# EAGLE schematic Schematic for AT-AT v4 (EAGLE 9.7.0)
SIM_ABSTOL: 1e-12; SIM_AC_SWEEP_TYPE: Dec; SIM_CHGTOL: 1e-15; SIM_GMIN: 1e-12; SIM_ITL1: 100; SIM_ITL2: 50; SIM_ITL4: 10; SIM_MAX_LIMIT: 2000; SIM_METHOD: TRAP; SIM_NUMPOINTS: 500; SIM_PIVREL: 1e-3; SIM_PIVTOL: 1e-13; SIM_RELTOL: 1e-3; SIM_RSHUNT: OFF; SIM_SRCSTEPS: 0; SIM_TEMPERATURE: 25.0; SIM_THEME: light; SIM_TRAN_AC_START: 1; SIM_TRTOL: 7; SIM_TYPE: Operating Point; SIM_VNTOL: 1e-6

## Sheet 1 of 2
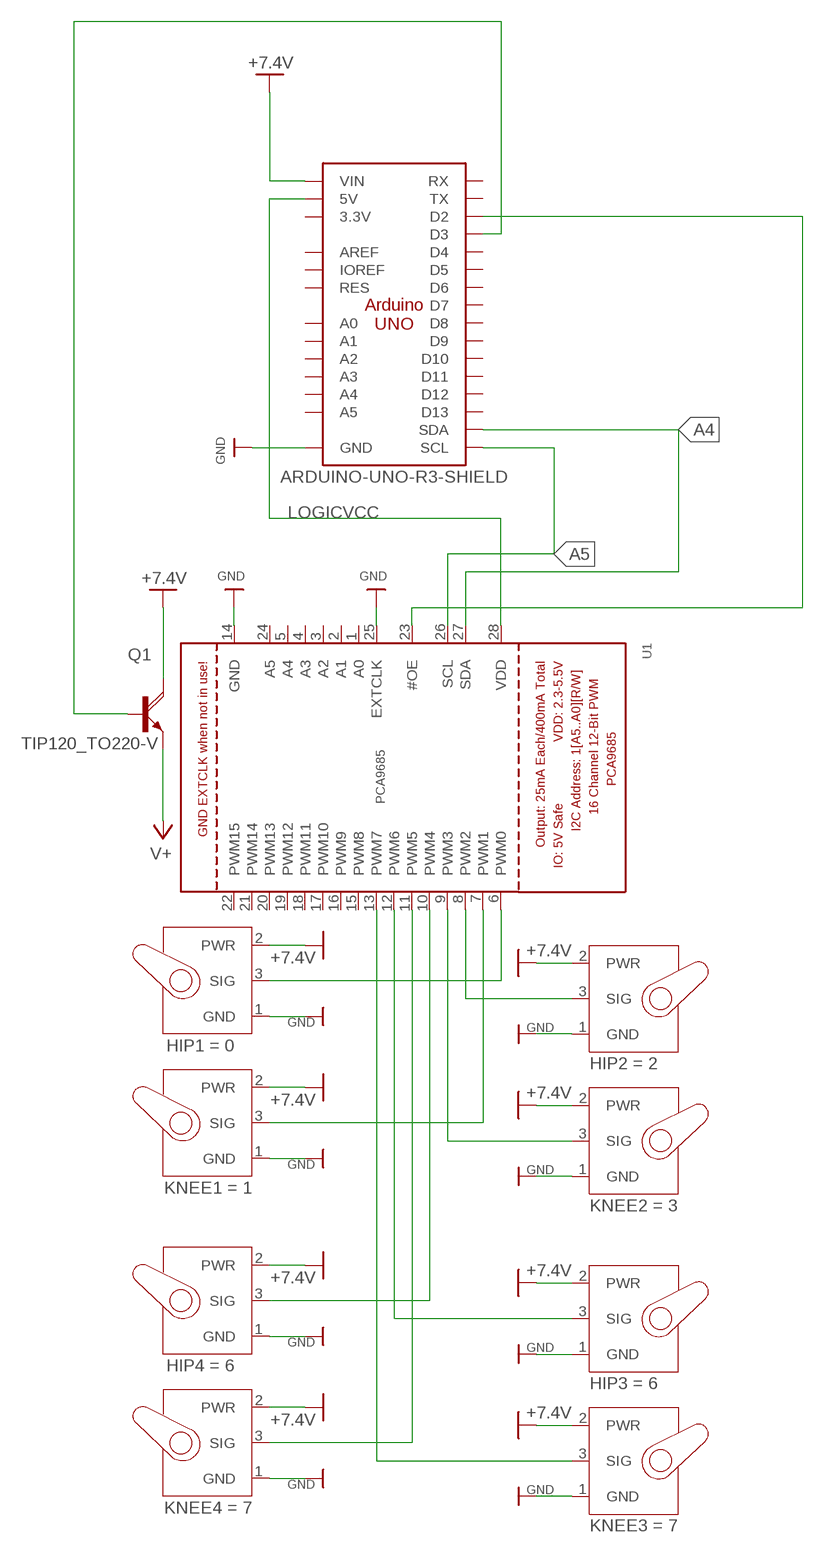
[diagram p0: schematic, sheet 1]

### Parts
Q1  TIP120_TO220-V  [TO220V]
U1  PCA9685  [TSSOP28]
U$1  SERVOSG90-HDR  [1X03]
U$2  SERVOSG90-HDR  [1X03]
U$3  SERVOSG90-HDR  [1X03]
U$4  SERVOSG90-HDR  [1X03]
U$5  SERVOSG90-HDR  [1X03]
U$6  SERVOSG90-HDR  [1X03]
U$7  SERVOSG90-HDR  [1X03]
U$8  SERVOSG90-HDR  [1X03]
U$9  ARDUINO-UNO-R3-SHIELD  [ARDUINO-UNO-R3-SHIELD]

### Nets
+7.4V: Q1.2(C) U$1.2(PWR) U$2.2(PWR) U$3.2(PWR) U$4.2(PWR) U$5.2(PWR) U$6.2(PWR) U$7.2(PWR) U$8.2(PWR) U$9.VIN
A4: U1.27(SDA) U$9.SDA ; also sheet 2
A5: U1.26(SCL) U$9.SCL ; also sheet 2
GND: U1.14(GND) U1.25(EXTCLK) U$1.1(GND) U$2.1(GND) U$3.1(GND) U$4.1(GND) U$5.1(GND) U$6.1(GND) U$7.1(GND) U$8.1(GND) U$9.GND@0(GND) U$9.GND@1(GND) U$9.GND@2(GND) ; also sheet 2
LOGICVCC: U1.28(VDD) U$9.5V
N$1: U1.6(PWM0) U$5.3(SIG)
N$2: U1.7(PWM1) U$6.3(SIG)
N$3: U1.8(PWM2) U$1.3(SIG)
N$4: U1.9(PWM3) U$2.3(SIG)
N$5: U1.10(PWM4) U$7.3(SIG)
N$6: U1.11(PWM5) U$8.3(SIG)
N$7: U1.12(PWM6) U$3.3(SIG)
N$8: U1.13(PWM7) U$4.3(SIG)
N$11: Q1.1(B) U$9.D3
N$12: U1.23(#OE) U$9.D2
V+: Q1.3(E)
Unconnected: U1.1(A0) U1.2(A1) U1.3(A2) U1.4(A3) U1.5(A4) U1.15(PWM8) U1.16(PWM9) U1.17(PWM10) U1.18(PWM11) U1.19(PWM12) U1.20(PWM13) U1.21(PWM14) U1.22(PWM15) U1.24(A5) U$9.3.3V U$9.A0 U$9.A1 U$9.A2 U$9.A3 U$9.A4 U$9.A5 U$9.AREF U$9.D4 U$9.D5 U$9.D6 U$9.D7 U$9.D8 U$9.D9 U$9.D10 U$9.D11 U$9.D12 U$9.D13 U$9.IOREF U$9.RES U$9.RX U$9.TX

## Sheet 2 of 2
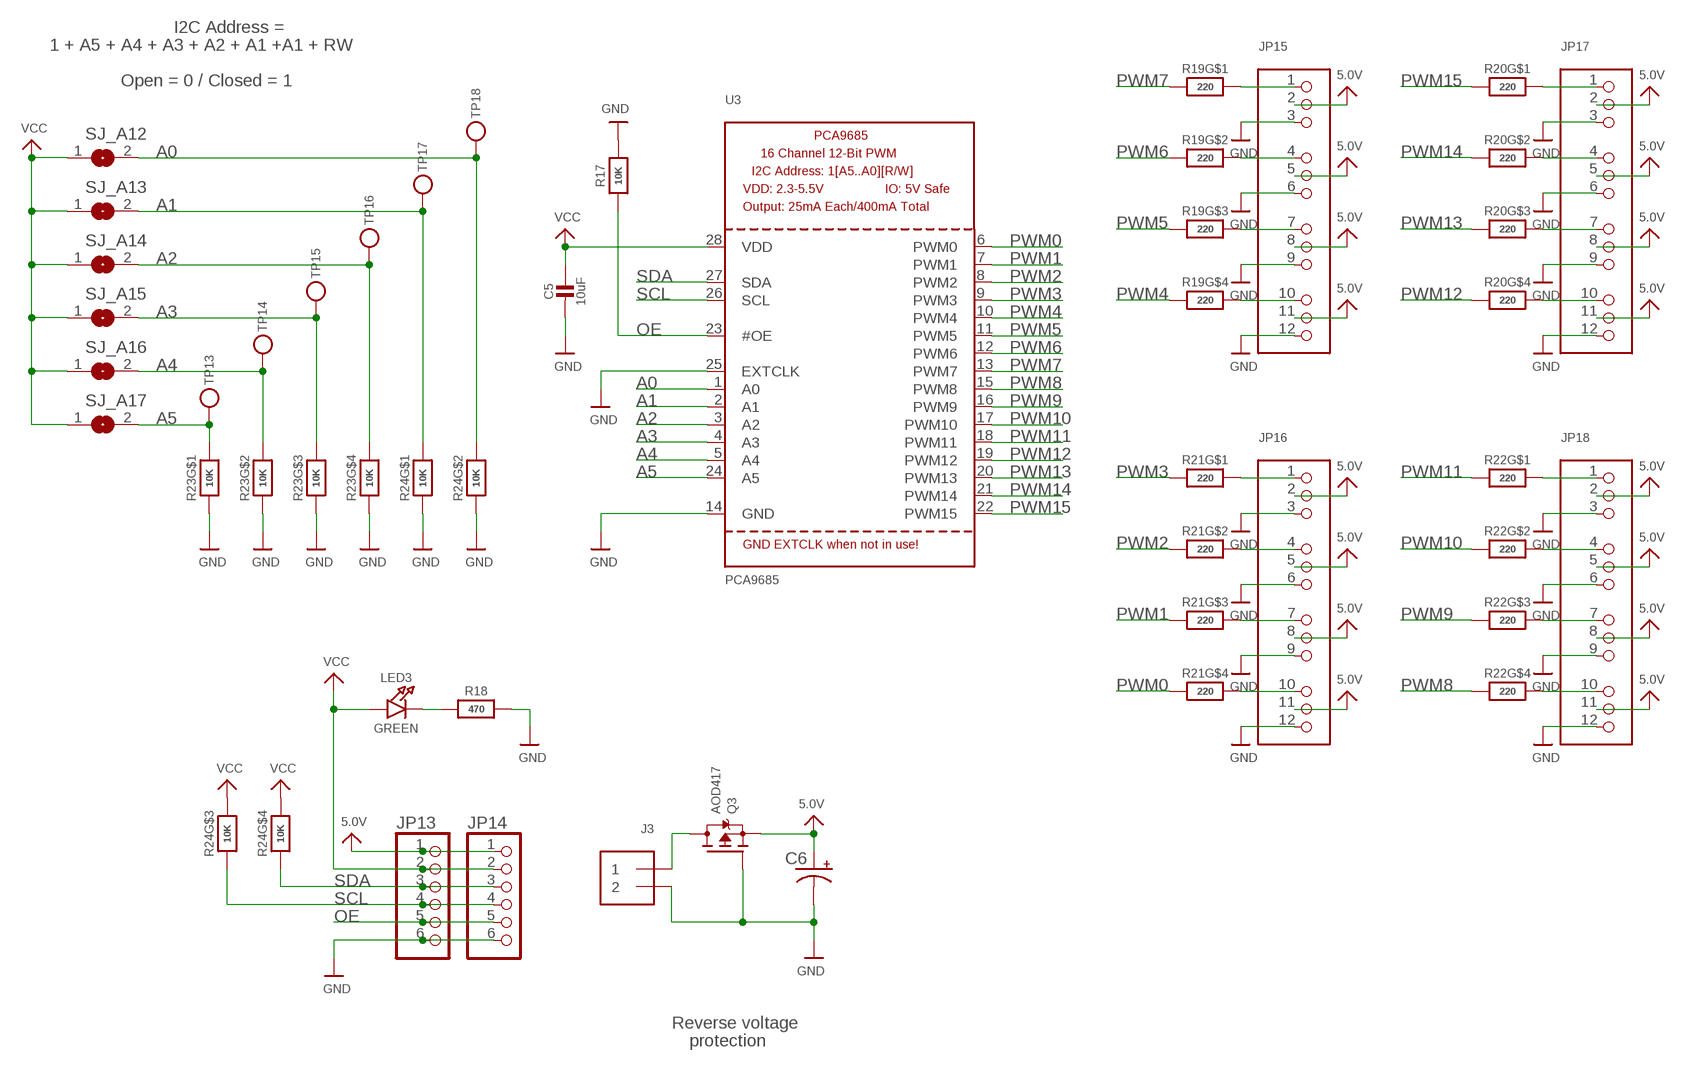
[diagram p1: schematic, sheet 2]

### Parts
C5  10uF  CAP_CERAMIC0805-NOOUTLINE  [0805-NO]
C6  CPOL-USE3.5-8  [E3,5-8]
J3  TERMBLOCK_1X2  [TERMBLOCK_1X2-3.5MM]
JP13  PINHD-1X6CB  [1X06-CLEANBIG]
JP14  PINHD-1X6CB  [1X06-CLEANBIG]
JP15  HEADER-3X04  [3X04]
JP16  HEADER-3X04  [3X04]
JP17  HEADER-3X04  [3X04]
JP18  HEADER-3X04  [3X04]
LED3  GREEN  LED0805_NOOUTLINE  [CHIPLED_0805_NOOUTLINE]
Q3  AOD417  MOSFET-PTO252  [TO252]
R17  10K  RESISTOR0805_NOOUTLINE  [0805-NO]
R18  470  RESISTOR_0805MP  [_0805MP]
R19  220  RESISTOR_4PACK  [RESPACK_4X0603]
R20  220  RESISTOR_4PACK  [RESPACK_4X0603]
R21  220  RESISTOR_4PACK  [RESPACK_4X0603]
R22  220  RESISTOR_4PACK  [RESPACK_4X0603]
R23  10K  RESISTOR_4PACK  [RESPACK_4X0603]
R24  10K  RESISTOR_4PACK  [RESPACK_4X0603]
SJ_A12  SOLDERJUMPERREFLOW_NOPASTE  [SOLDERJUMPER_REFLOW_NOPASTE]
SJ_A13  SOLDERJUMPERREFLOW_NOPASTE  [SOLDERJUMPER_REFLOW_NOPASTE]
SJ_A14  SOLDERJUMPERREFLOW_NOPASTE  [SOLDERJUMPER_REFLOW_NOPASTE]
SJ_A15  SOLDERJUMPERREFLOW_NOPASTE  [SOLDERJUMPER_REFLOW_NOPASTE]
SJ_A16  SOLDERJUMPERREFLOW_NOPASTE  [SOLDERJUMPER_REFLOW_NOPASTE]
SJ_A17  SOLDERJUMPERREFLOW_NOPASTE  [SOLDERJUMPER_REFLOW_NOPASTE]
TP13  TESTPOINTROUND1MM  [TESTPOINT_ROUND_1MM]
TP14  TESTPOINTROUND1MM  [TESTPOINT_ROUND_1MM]
TP15  TESTPOINTROUND1MM  [TESTPOINT_ROUND_1MM]
TP16  TESTPOINTROUND1MM  [TESTPOINT_ROUND_1MM]
TP17  TESTPOINTROUND1MM  [TESTPOINT_ROUND_1MM]
TP18  TESTPOINTROUND1MM  [TESTPOINT_ROUND_1MM]
U3  PCA9685  [TSSOP28]

### Nets
5.0V: C6.+ JP13.1 JP14.1 JP15.2 JP15.5 JP15.8 JP15.11 JP16.2 JP16.5 JP16.8 JP16.11 JP17.2 JP17.5 JP17.8 JP17.11 JP18.2 JP18.5 JP18.8 JP18.11 Q3.2(S)
A0: R24.7 SJ_A12.2 TP18.P$1 U3.1(A0)
A1: R24.8 SJ_A13.2 TP17.P$1 U3.2(A1)
A2: R23.5 SJ_A14.2 TP16.P$1 U3.3(A2)
A3: R23.6 SJ_A15.2 TP15.P$1 U3.4(A3)
A4: R23.7 SJ_A16.2 TP14.P$1 U3.5(A4) ; also sheet 1
A5: R23.8 SJ_A17.2 TP13.P$1 U3.24(A5) ; also sheet 1
GND: C5.2 C6.- J3.2 JP13.6 JP14.6 JP15.3 JP15.6 JP15.9 JP15.12 JP16.3 JP16.6 JP16.9 JP16.12 JP17.3 JP17.6 JP17.9 JP17.12 JP18.3 JP18.6 JP18.9 JP18.12 Q3.1(G) R17.2 R18.2 R23.1 R23.2 R23.3 R23.4 R24.1 R24.2 U3.14(GND) U3.25(EXTCLK) ; also sheet 1
N$35: LED3.C R18.1
N$36: JP15.4 R19.7
N$37: JP15.1 R19.8
N$38: JP15.7 R19.6
N$39: JP15.10 R19.5
N$40: JP16.1 R21.8
N$41: JP16.4 R21.7
N$42: JP16.7 R21.6
N$43: JP16.10 R21.5
N$44: JP18.10 R22.5
N$45: JP18.7 R22.6
N$46: JP18.4 R22.7
N$47: JP18.1 R22.8
N$48: JP17.10 R20.5
N$49: JP17.7 R20.6
N$50: JP17.4 R20.7
N$51: JP17.1 R20.8
OE: JP13.5 JP14.5 R17.1 U3.23(#OE)
PWM0: R21.4 U3.6(PWM0)
PWM1: R21.3 U3.7(PWM1)
PWM2: R21.2 U3.8(PWM2)
PWM3: R21.1 U3.9(PWM3)
PWM4: R19.4 U3.10(PWM4)
PWM5: R19.3 U3.11(PWM5)
PWM6: R19.2 U3.12(PWM6)
PWM7: R19.1 U3.13(PWM7)
PWM8: R22.4 U3.15(PWM8)
PWM9: R22.3 U3.16(PWM9)
PWM10: R22.2 U3.17(PWM10)
PWM11: R22.1 U3.18(PWM11)
PWM12: R20.4 U3.19(PWM12)
PWM13: R20.3 U3.20(PWM13)
PWM14: R20.2 U3.21(PWM14)
PWM15: R20.1 U3.22(PWM15)
PWRIN2: J3.1 Q3.3(D)
SCL: JP13.4 JP14.4 R24.3 U3.26(SCL)
SDA: JP13.3 JP14.3 R24.4 U3.27(SDA)
VCC: C5.1 JP13.2 JP14.2 LED3.A R24.5 R24.6 SJ_A12.1 SJ_A13.1 SJ_A14.1 SJ_A15.1 SJ_A16.1 SJ_A17.1 U3.28(VDD)

### Notes on the sheet
- I2C Address =
- 1 + A5 + A4 + A3 + A2 + A1 +A1 + RW
- Open = 0 / Closed = 1
- Reverse voltage
- protection

## Library data of the parts
C5 = microbuilder:CAP_CERAMIC: Ceramic Capacitors For new designs, use the packages preceded by an '_' character since they are more reliable: The following footprints should be used on most boards: _0402 - Standard footprint for regular board layouts _0603 - Standard footprint for regular board layouts _0805 - Standard footprint for regular board layouts _1206 - Standard footprint for regular board layouts For extremely tight-pitch boards where space is at a premium, the following 'micro-pitch' footprints can be used (smaller pads, no silkscreen outline, etc.): _0402MP - Micro-pitch footprint for very dense/compact boards _0603MP - Micro-pitch footprint for very dense/compact boards _0805MP - Micro-pitch footprint for very dense/compact boards _1206MP - Micro-pitch footprint for very dense/compact boards
C6 = adafruit:CPOL-US: POLARIZED CAPACITOR, American symbol
J3 = microbuilder:TERMBLOCK_1X2: 3.5mm Terminal block http://www.ladyada.net/library/pcb/eaglelibrary.html
JP13 JP14 = adafruit:PINHD-1X6: PIN HEADER
JP15-JP18 = microbuilder:HEADER-3X04
LED3 = microbuilder:LED: LED 0603 - 0603 Surface Mount Package 2mA: Green LED - Low Power (3.9mcd, 2ma, 1.7Vf) - Digikey: 475-2709-2-ND Orange LED - Low Power (9.8mcd, 2ma, 1.8Vf) - Digikey: 475-1194-2-ND Red LED - Low Power (5mcd, 2ma, 1.8Vf) - Digikey: 475-1195-2-ND Yellow LED - Low Power (7mcd, 2ma, 1.8Vf) - Digikey: 475-1196-2-ND 5mA: Blue LED - Low Power (17mcd, 5ma, 2.9Vf) - Digikey: LNJ937W8CRACT-ND 0805 - 0805 Surface Mount Package 2mA: Red LED (8.8mcd, 2mA, 1.8Vf, Clear) - Low Power [Digikey: 475-2510-1-ND] Green LED (5mcd, 2mA, 1.8Vf, Clear) - Low Power [Digikey: 475-2730-1-ND] Yellow LED (11.3mcd, 2mA, 1.8Vf, Clear) - Low Power [Digikey: 475-2555-1-ND] 20mA: Red LED (104mcd, 20mA, Diffused) - LS R976 [Digikey: 475-1278-6-ND] Red LED (12mcd, 20mA, 2.0Vf, Clear) - APT2012EC [Digikey: 754-1128-1-ND] Green LED (15mcd, 20mA, 2.2Vf, Clear) - APT2012GC [Digikey: 754-1131-1-ND] Orange LED (160mcd, 20mA, 2.1Vf, Clear) - APT2012SECK [Digikey: 754-1130-1-ND] 1206 - 1206 Surface Mount Package Green LED (26mcd, 20mA, Diffused) - LG N971 [Digikey: 475-1407-6-ND] Red LED (15mcd, 20mA, Diffused) - LH N974 [Digikey: 475-1416-6-ND] Cree - Cree High-Power Surface Mount LEDs XPEBWT-L1-0000-00D50 - White 111lm 350mA 2.9Vf 6200K 110° XTEAWT-00-0000-00000LEE3 - White 114lm 350mA 2.85Vf 5000K 115° Everlight - Everlight 45-21 Series Surface Mount LEDs 45-21/QK2C-B2832AC2CB2/2T - Warm White 2000mcd 20mA 3.25Vf 3050K 120° 45-21/LK2C-B38452C4CB2/2T - Nuetral White 2000mcd 20mA 3.25Vf 4150K 120° 45-21/LK2C-B50634C6CB2/2T - Cold White 2200mcd 20mA 3.25Vf 5650K 120° PLCC2 Reverse Mount LS T77K-J1L2-1-0-2-R18-Z - Red 11.25mcd 2mA 1.8Vf 630nm 120° LO T77K-L1M2-24-Z - Orange 19.6mcd 2mA 1.8Vf 606nm 120° LY T77K-K2M1-26-Z - Yellow 15.7mcd 2mA 1.8Vf 587nm 120°
Q1 = Tinkercad:TIP120: NPN DARLINGTON TRANSISTOR
Q3 = microbuilder:MOSFET-P: P-Channel Mosfet LEGEND VDS: Voltage Drain-Source ID: Drain Current RDS(ON): Drain-Source On-State Resistance VGS(TH): Gate-Source Threshold Voltage CISS: Drain-Source Input Capacitance SOT-23 Name VDS ID RDS(ON) VGS(TH) CISS Order Number IRLML5103 30V 760mA 600 mOhm -- 75pF @ 25V Digikey: IRLML5103PBFCT-ND IRLML6401 12V 4.3A 50 mOhm 950mV @ 250µA 830pF @ 10V Digikey: IRLML6401PBFTR-ND NTR0202PL 20V 400mA 800 mOhm 2.3V @ 250uA 70pF @ 5V Digikey: NTR0202PLT1GOSTR-ND NTR4101PT1G 20V 1.8A 85 mOhm 1.2V @ 250uA 675pF @ 10V Digikey: NTR4101PT1GOSCT-ND DMP2004K 20V 600mA 900 mOhm 1V @ 250uA 175pF @ 16V Digikey: DMP2004KDICT-ND PMV65XP 20V 3.9A 76 mOhm 950mV @ 1mA 725pF @ 20V Digikey: 568-2358-2-ND TO-252 Name VDS ID RDS(ON) VGS(TH) CISS Order Number AOD417 30V 25A 34 mOhm 3V @ 250µA 920pF @ 15V Digikey: 785-1106-2-ND
R17 R18 = microbuilder:RESISTOR: Resistors For new designs, use the packages preceded by an '_' character since they are more reliable: The following footprints should be used on most boards: _0402 - Standard footprint for regular board layouts _0603 - Standard footprint for regular board layouts _0805 - Standard footprint for regular board layouts _1206 - Standard footprint for regular board layouts For extremely tight-pitch boards where space is at a premium, the following 'micro-pitch' footprints can be used (smaller pads, no silkscreen outline, etc.): _0402MP - Micro-pitch footprint for very dense/compact boards _0603MP - Micro-pitch footprint for very dense/compact boards _0805MP - Micro-pitch footprint for very dense/compact boards _1206MP - Micro-pitch footprint for very dense/compact boards
R19-R24 = microbuilder:RESISTOR_4PACK: Resistor Packs (4 resistors) 4 x 0603 10K 1/16W - Digikey: YC164J-10KCT-ND
SJ_A12-SJ_A17 = microbuilder:SOLDERJUMPER: SMD Solder JUMPER Solder the two pads together to create a connection, or remove the solder to break it. REFLOW - Use this footprint for solder paste and reflow ovens. WAVE - Use this footprint for hand-soldering (larger pads). CLOSED - Has a trace between the two pads to ensure it is closed by default. The trace needs to be cut to disable the jumper, and can be closed again by creating a solder bridge between the two pads.
TP13-TP18 = microbuilder:TESTPOINT: Test Point Various test points for characterisation and PCB testing TESTPOINT_SMT - Compact Surface Mount Test Point [Digikey: 5016KTR-ND]
U1 U3 = microbuilder:PCA9685: PCA9685 - 16 Channel 12-Bit I2C PWM Controller 5.0V tolerant 16 channel, 12-bit I2C PWM controller with 25mA per output (max. 400mA total) Digikey: 568-5931-1-ND
U$1 = Tinkercad:SERVO; HIP2: 2
U$2 = Tinkercad:SERVO; KNEE2: 3
U$3 = Tinkercad:SERVO; HIP3: 6
U$4 = Tinkercad:SERVO; KNEE3: 7
U$5 = Tinkercad:SERVO; HIP1: 0
U$6 = Tinkercad:SERVO; KNEE1: 1
U$7 = Tinkercad:SERVO; HIP4: 6
U$8 = Tinkercad:SERVO; KNEE4: 7
U$9 = Tinkercad:ARDUINO-UNO-R3-SHIELD